# Altium schematic sheet WanderDrive_Gate_Driver_2.SchDoc (part 1 of 2)
size A3; SheetNumber: 2; SheetTotal: 4
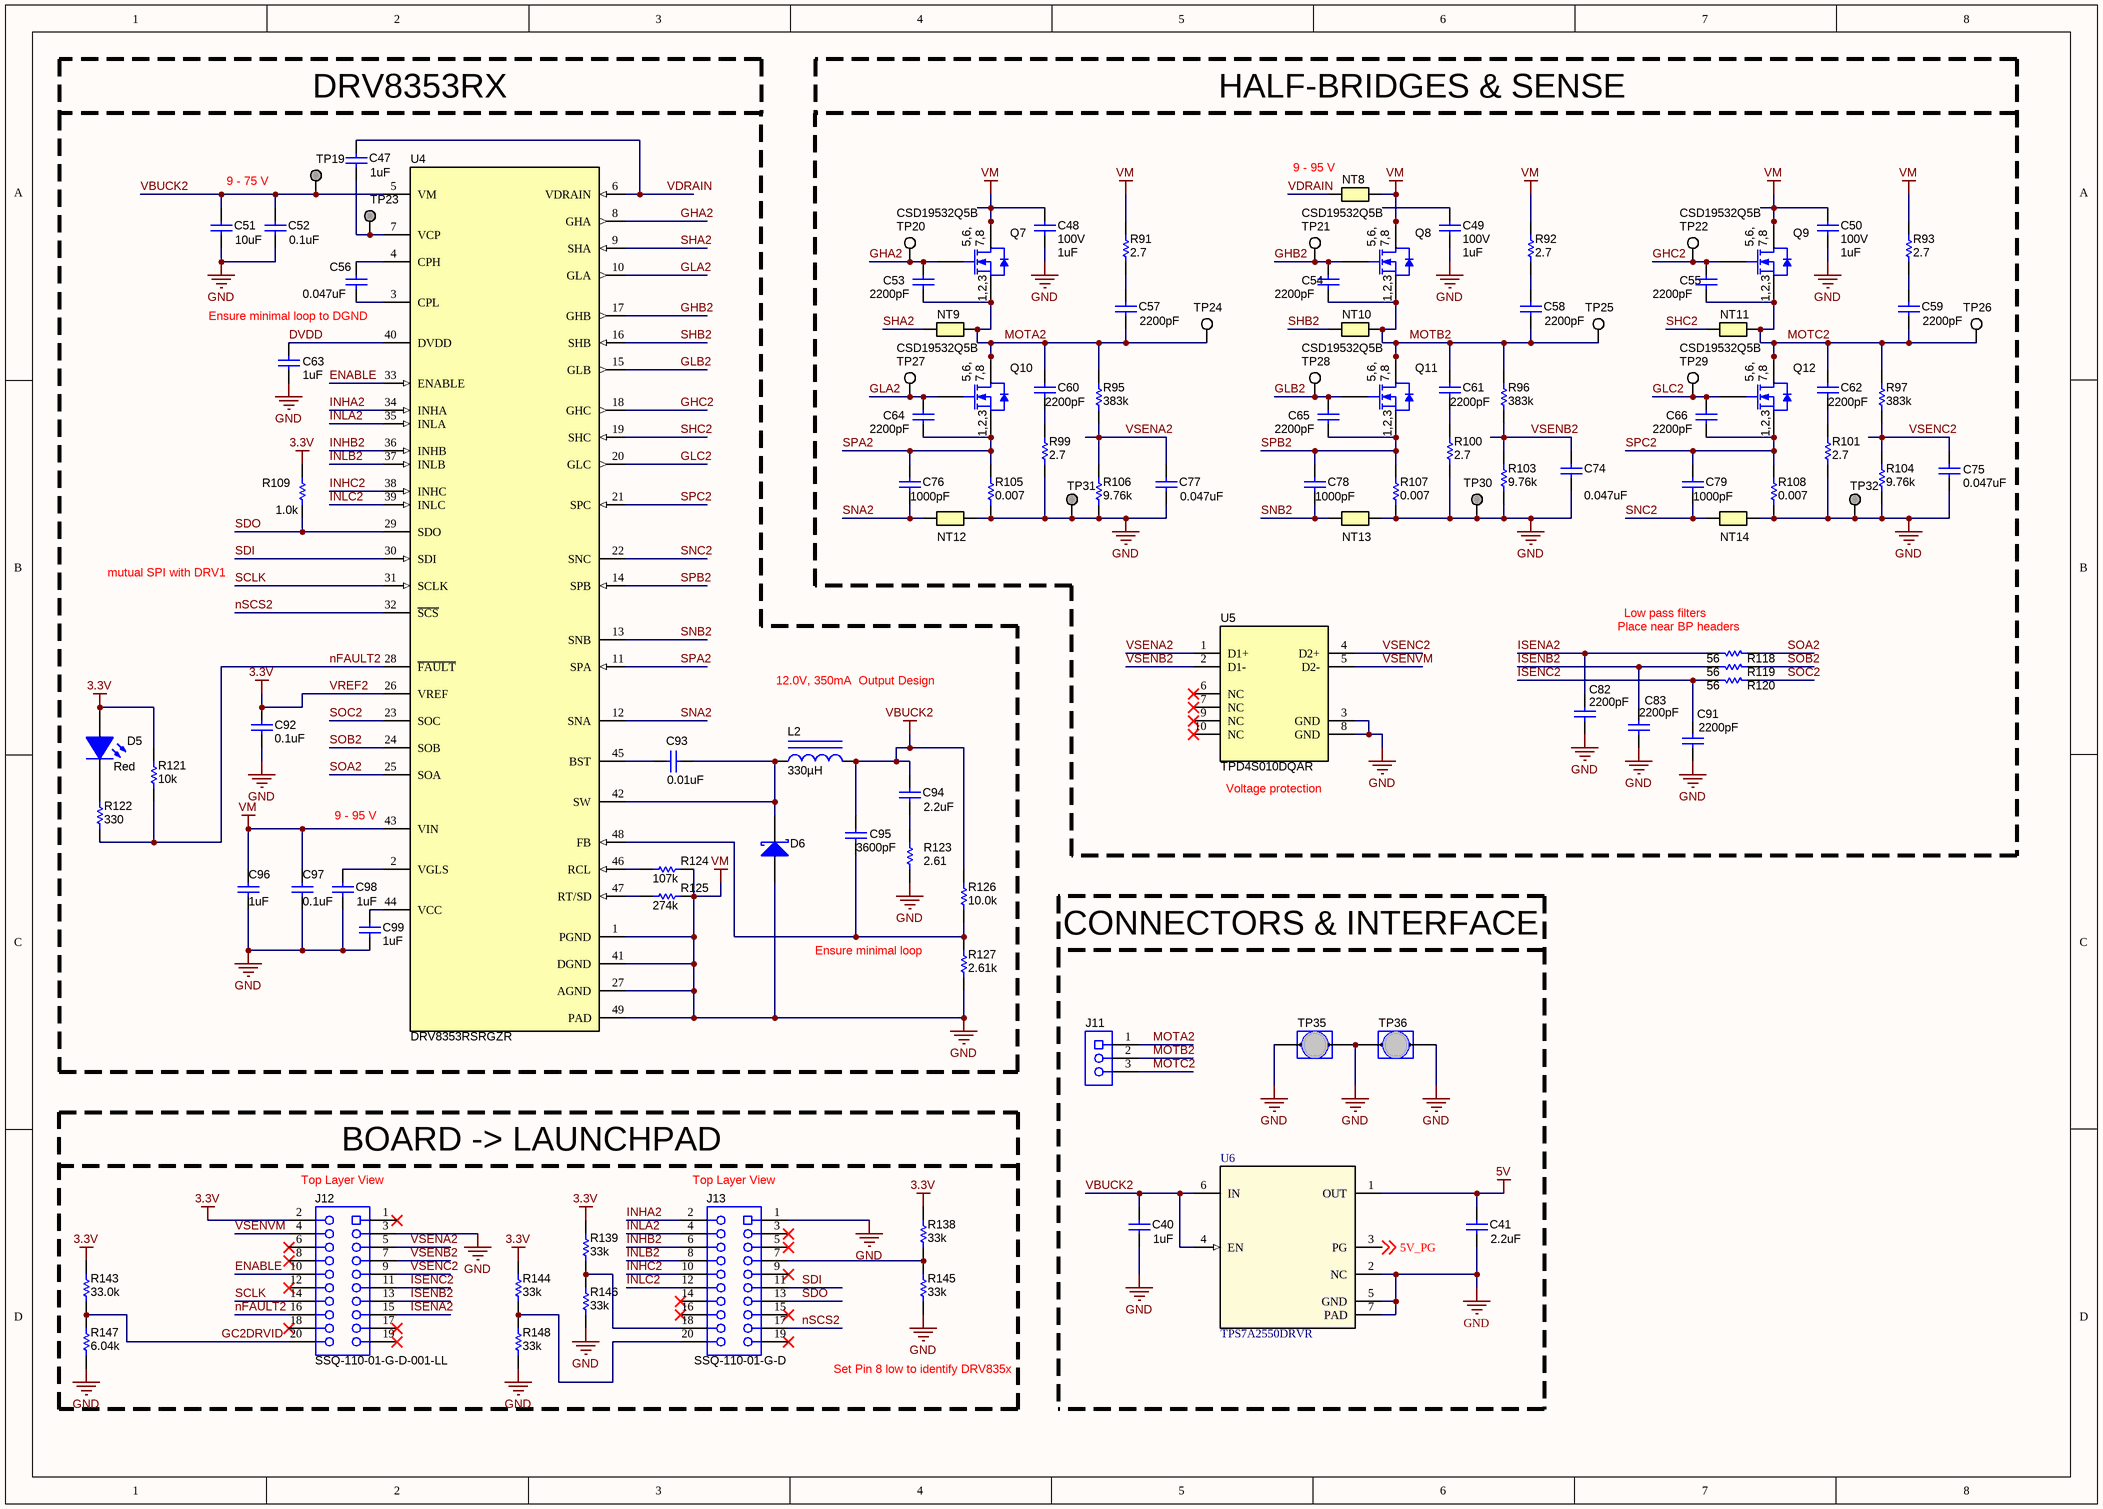
[diagram p0: WanderDrive_Gate_Driver_2.SchDoc]

## Parts
C40  ValueDisplayed: 1uF  [0805L]  (hidden comment: CL21B105KBFNNNE)
C41  ValueDisplayed: 2.2uF  [1210_270L]  (hidden comment: GRM32ER71K475KE14L)
C47  ValueDisplayed: 1uF  [1206_180M]  (hidden comment: CL31B105KCHNNNE)
C48  VDC_V: 100V  ValueDisplayed: 1uF  [1206_180M]  (hidden comment: CL31B105KCHNNNE)
C49  VDC_V: 100V  ValueDisplayed: 1uF  [1206_180M]  (hidden comment: CL31B105KCHNNNE)
C50  VDC_V: 100V  ValueDisplayed: 1uF  [1206_180M]  (hidden comment: CL31B105KCHNNNE)
C51  ValueDisplayed: 10uF  [2220_280M]  (hidden comment: CGA9N3X7S2A106K230KE)
C52  ValueDisplayed: 0.1uF  [0805_HV]  (hidden comment: C2012X7R2A104K125AA)
C53  ValueDisplayed: 2200pF  [0603_HV]  (hidden comment: 06031C222KAT2A)
C54  ValueDisplayed: 2200pF  [0603_HV]  (hidden comment: 06031C222KAT2A)
C55  ValueDisplayed: 2200pF  [0603_HV]  (hidden comment: 06031C222KAT2A)
C56  ValueDisplayed: 0.047uF  [0805_HV]  (hidden comment: C2012X7R2A473K125AA)
C57  ValueDisplayed: 2200pF  [0603_HV]  (hidden comment: GRM188R72A222KA01D)
C58  ValueDisplayed: 2200pF  [0603_HV]  (hidden comment: GRM188R72A222KA01D)
C59  ValueDisplayed: 2200pF  [0603_HV]  (hidden comment: GRM188R72A222KA01D)
C60  ValueDisplayed: 2200pF  [0603_HV]  (hidden comment: GRM188R72A222KA01D)
C61  ValueDisplayed: 2200pF  [0603_HV]  (hidden comment: GRM188R72A222KA01D)
C62  ValueDisplayed: 2200pF  [0603_HV]  (hidden comment: GRM188R72A222KA01D)
C63  ValueDisplayed: 1uF  [0603L]  (hidden comment: EMK107B7105KA-T)
C64  ValueDisplayed: 2200pF  [0603_HV]  (hidden comment: 06031C222KAT2A)
C65  ValueDisplayed: 2200pF  [0603_HV]  (hidden comment: 06031C222KAT2A)
C66  ValueDisplayed: 2200pF  [0603_HV]  (hidden comment: 06031C222KAT2A)
C74  ValueDisplayed: 0.047uF  [0603L]  (hidden comment: 06033C473JAT2A)
C75  ValueDisplayed: 0.047uF  [0603L]  (hidden comment: 06033C473JAT2A)
C76  ValueDisplayed: 1000pF  [0603L]  (hidden comment: 885012206034)
C77  ValueDisplayed: 0.047uF  [0603L]  (hidden comment: 06033C473JAT2A)
C78  ValueDisplayed: 1000pF  [0603L]  (hidden comment: 885012206034)
C79  ValueDisplayed: 1000pF  [0603L]  (hidden comment: 885012206034)
C82  ValueDisplayed: 2200pF  [0603L]  (hidden comment: GRM188R71C222KA01D)
C83  ValueDisplayed: 2200pF  [0603L]  (hidden comment: GRM188R71C222KA01D)
C91  ValueDisplayed: 2200pF  [0603L]  (hidden comment: GRM188R71C222KA01D)
C92  ValueDisplayed: 0.1uF  [0603L]  (hidden comment: C0603C104J4RACTU)
C93  ValueDisplayed: 0.01uF  [0603L]  (hidden comment: C0603C103K4RACTU)
C94  ValueDisplayed: 2.2uF  [0805L]  (hidden comment: C2012X7R1V225K085AC)
C95  ValueDisplayed: 3600pF  [0603L]  (hidden comment: GRM1885C1H362JA01D)
C96  ValueDisplayed: 1uF  [1206_180M]  (hidden comment: CL31B105KCHNNNE)
C97  ValueDisplayed: 0.1uF  [0805_HV]  (hidden comment: C2012X7R2A104K125AA)
C98  ValueDisplayed: 1uF  [0603L]  (hidden comment: C1608X7R1C105K080AC)
C99  ValueDisplayed: 1uF  [0603L]  (hidden comment: C1608X7R1C105K080AC)
D5  value Red  [LED_LTST-C170_Red]  (hidden comment: LTST-C170KRKT)
D6  DFLS1200-7  [PowerDI123]  (value not drawn)
J11  1904150  [Phoenix_1904150]  (value not drawn)
J12  SSQ-110-01-G-D-001-LL  [Samtec_SSQ-110-01-x-D-001-LL]
J13  SSQ-110-01-G-D  [Samtec_SSQ-110-01-x-D]
L2  ValueDisplayed: 330µH  [WE-LQS_8040]  (hidden comment: 74404084331)
NT8  Net-Tie  [Net-Tie_50milWide_30milLong]  (value not drawn)  (net tie, no BOM)
NT9  Net-Tie  [Net-Tie_10mil]  (value not drawn)  (net tie, no BOM)
NT10  Net-Tie  [Net-Tie_10mil]  (value not drawn)  (net tie, no BOM)
NT11  Net-Tie  [Net-Tie_10mil]  (value not drawn)  (net tie, no BOM)
NT12  Net-Tie  [Net-Tie_10mil]  (value not drawn)  (net tie, no BOM)
NT13  Net-Tie  [Net-Tie_10mil]  (value not drawn)  (net tie, no BOM)
NT14  Net-Tie  [Net-Tie_10mil]  (value not drawn)  (net tie, no BOM)
Q7  CSD19532Q5B  [DNK0008A]
Q8  CSD19532Q5B  [DNK0008A]
Q9  CSD19532Q5B  [DNK0008A]
Q10  CSD19532Q5B  [DNK0008A]
Q11  CSD19532Q5B  [DNK0008A]
Q12  CSD19532Q5B  [DNK0008A]
R91  ValueDisplayed: 2.7  [0805_HV]  (hidden comment: CRCW08052R70JNEA)
R92  ValueDisplayed: 2.7  [0805_HV]  (hidden comment: CRCW08052R70JNEA)
R93  ValueDisplayed: 2.7  [0805_HV]  (hidden comment: CRCW08052R70JNEA)
R95  ValueDisplayed: 383k  [0603_HV]  (hidden comment: CRCW0603383KFKEA)
R96  ValueDisplayed: 383k  [0603_HV]  (hidden comment: CRCW0603383KFKEA)
R97  ValueDisplayed: 383k  [0603_HV]  (hidden comment: CRCW0603383KFKEA)
R99  ValueDisplayed: 2.7  [0805_HV]  (hidden comment: CRCW08052R70JNEA)
R100  ValueDisplayed: 2.7  [0805_HV]  (hidden comment: CRCW08052R70JNEA)
R101  ValueDisplayed: 2.7  [0805_HV]  (hidden comment: CRCW08052R70JNEA)
R103  ValueDisplayed: 9.76k  [0603L]  (hidden comment: RC0603FR-079K76L)
R104  ValueDisplayed: 9.76k  [0603L]  (hidden comment: RC0603FR-079K76L)
R105  ValueDisplayed: 0.007  [CRE2512-R5_R9]  (hidden comment: CRE2512-FZ-R007E-3)
R106  ValueDisplayed: 9.76k  [0603L]  (hidden comment: RC0603FR-079K76L)
R107  ValueDisplayed: 0.007  [CRE2512-R5_R9]  (hidden comment: CRE2512-FZ-R007E-3)
R108  ValueDisplayed: 0.007  [CRE2512-R5_R9]  (hidden comment: CRE2512-FZ-R007E-3)
R109  ValueDisplayed: 1.0k  [0603L]  (hidden comment: RCA06031K00JNEA)
R118  value 56  [0603L]  (hidden comment: CRCW060356R0JNEA)
R119  value 56  [0603L]  (hidden comment: CRCW060356R0JNEA)
R120  value 56  [0603L]  (hidden comment: CRCW060356R0JNEA)
R121  ValueDisplayed: 10k  [0603L]  (hidden comment: RC0603JR-0710KL)
R122  ValueDisplayed: 330  [0603L]  (hidden comment: CRCW0603330RJNEA)
R123  ValueDisplayed: 2.61  [0603L]  (hidden comment: CRCW06032R61FKEA)
R124  ValueDisplayed: 107k  [0603L]  (hidden comment: RC0603FR-07107KL)
R125  ValueDisplayed: 274k  [0603_HV]  (hidden comment: RC0603FR-07274KL)
R126  ValueDisplayed: 10.0k  [0603L]  (hidden comment: RG1608P-103-B-T5)
R127  ValueDisplayed: 2.61k  [0603L]  (hidden comment: RG1608P-2611-B-T5)
R138  ValueDisplayed: 33k  [0603L]  (hidden comment: Resistor)
R139  ValueDisplayed: 33k  [0603L]  (hidden comment: Resistor)
R143  ValueDisplayed: 33.0k  [0603L]  (hidden comment: MCT06030C3302FP500)
R144  ValueDisplayed: 33k  [0603L]  (hidden comment: Resistor)
R145  ValueDisplayed: 33k  [0603L]  (hidden comment: Resistor)
R146  ValueDisplayed: 33k  [0603L]  (hidden comment: Resistor)
R147  ValueDisplayed: 6.04k  [0603L]  (hidden comment: RG1608P-6041-B-T5)
R148  ValueDisplayed: 33k  [0603L]  (hidden comment: Resistor)
TP19  TP_SM_1MM  [TP_SM_1MM]  (value not drawn)  (no BOM)
TP20  5002  [Keystone5002]  (value not drawn)
TP21  5002  [Keystone5002]  (value not drawn)
TP22  5002  [Keystone5002]  (value not drawn)
TP23  TP_SM_1MM  [TP_SM_1MM]  (value not drawn)  (no BOM)
TP24  5002  [Keystone5002]  (value not drawn)
TP25  5002  [Keystone5002]  (value not drawn)
TP26  5002  [Keystone5002]  (value not drawn)
TP27  5002  [Keystone5002]  (value not drawn)
TP28  5002  [Keystone5002]  (value not drawn)
TP29  5002  [Keystone5002]  (value not drawn)
TP30  TP_SM_1MM  [TP_SM_1MM]  (value not drawn)  (no BOM)
TP31  TP_SM_1MM  [TP_SM_1MM]  (value not drawn)  (no BOM)
TP32  TP_SM_1MM  [TP_SM_1MM]  (value not drawn)  (no BOM)
TP35  D3082-05  [Harwin_D3082-05]  (value not drawn)
TP36  D3082-05  [Harwin_D3082-05]  (value not drawn)
U4  DRV8353RSRGZR  [RGZ0048L]
U5  TPD4S010DQAR  [DQA0010A]
U6  TPS7A2550DRVR  [DRV0006A]

## Blocks framed on the sheet
BOARD -> LAUNCHPAD: J12 J13 R138 R139 R143-R148

## Nets
5V: C41.1 U6.1(OUT)
GND: C40.2 C41.2 C48.1 C48.2 C49.2 C50.1 C50.2 C51.2 C52.2 C63.2 C74.2 C75.2 C77.2 C82.2 C83.2 C91.2 C92.2 C96.1 C96.2 C97.1 C97.2 C98.2 C99.1 D6.2(A) J12.3 J13.1 NT8.2 NT12.2 NT13.2 NT14.2 Q7.5(D) Q7.6(D) Q7.7(D) Q7.8(D) Q7.9(D) Q8.5(D) Q8.6(D) Q8.7(D) Q8.8(D) Q8.9(D) Q9.5(D) Q9.6(D) Q9.7(D) Q9.8(D) Q9.9(D) R91.2 R92.2 R93.2 R99.1 R100.1 R101.1 R103.1 R104.1 R105.1 R106.1 R107.1 R108.1 R123.1 R124.2 R125.2 R127.1 R145.1 R146.1 R147.1 R148.1 TP30.1 TP31.1 TP32.1 TP35.1 TP35.2 TP36.1 TP36.2 U4.1(PGND) U4.27(AGND) U4.41(DGND) U4.43(VIN) U4.49(PAD) U5.3(GND) U5.8(GND) U6.2(NC) U6.5(GND) U6.7(PAD)  [also labelled VM]
VBUCK2: C40.1 C51.1 C52.1 C94.1 C95.1 L2.2 R126.2 TP19.1 U4.5(VM) U6.4(EN) U6.6(IN)
VREF2: C92.1 D5.1(A) J12.2 R109.2 R121.2 R138.2 R139.2 R143.2 R144.2 U4.26(VREF)  [also labelled 3.3V]
5V_PG: U6.3(PG) ; off-sheet 5V_PG
DVDD: C63.1 U4.40(DVDD)
ENABLE: J12.10 U4.33(ENABLE)
GC2DRVID: J12.20 R143.1 R147.2
GHA2: C53.1 Q7.4(G) TP20.1 U4.8(GHA)
GHB2: C54.1 Q8.4(G) TP21.1 U4.17(GHB)
GHC2: C55.1 Q9.4(G) TP22.1 U4.18(GHC)
GLA2: C64.1 Q10.4(G) TP27.1 U4.10(GLA)
GLB2: C65.1 Q11.4(G) TP28.1 U4.15(GLB)
GLC2: C66.1 Q12.4(G) TP29.1 U4.20(GLC)
INHA2: J13.2 U4.34(INHA)
INHB2: J13.6 U4.36(INHB)
INHC2: J13.10 U4.38(INHC)
INLA2: J13.4 U4.35(INLA)
INLB2: J13.8 U4.37(INLB)
INLC2: J13.12 U4.39(INLC)
ISENA2: C82.1 J12.15 R118.2
ISENB2: C83.1 J12.13 R119.2
ISENC2: C91.1 J12.11 R120.2
MOTA2: C53.2 C57.2 C60.1 J11.1 NT9.2 Q7.1(S) Q7.2(S) Q7.3(S) Q10.5(D) Q10.6(D) Q10.7(D) Q10.8(D) Q10.9(D) R95.2 TP24.1
MOTB2: C54.2 C58.2 C61.1 J11.2 NT10.2 Q8.1(S) Q8.2(S) Q8.3(S) Q11.5(D) Q11.6(D) Q11.7(D) Q11.8(D) Q11.9(D) R96.2 TP25.1
MOTC2: C55.2 C59.2 C62.1 J11.3 NT11.2 Q9.1(S) Q9.2(S) Q9.3(S) Q12.5(D) Q12.6(D) Q12.7(D) Q12.8(D) Q12.9(D) R97.2 TP26.1
nFAULT2: J12.16 R121.1 R122.1 U4.28(~{FAULT})
nSCS2: J13.17 U4.32(~{SCS})
SCLK: J12.14 U4.31(SCLK)
SDI: J13.11 U4.30(SDI)
SDO: J13.13 R109.1 U4.29(SDO)
SHA2: NT9.1 U4.9(SHA)
SHB2: NT10.1 U4.16(SHB)
SHC2: NT11.1 U4.19(SHC)
SNA2: C76.2 NT12.1 U4.12(SNA)
SNB2: C78.2 NT13.1 U4.13(SNB)
SNC2: C79.2 NT14.1 U4.22(SNC)
SOA2: R118.1 U4.25(SOA)
SOB2: R119.1 U4.24(SOB)
SOC2: R120.1 U4.23(SOC)
SPA2: C64.2 C76.1 Q10.1(S) Q10.2(S) Q10.3(S) R105.2 U4.11(SPA)
SPB2: C65.2 C78.1 Q11.1(S) Q11.2(S) Q11.3(S) R107.2 U4.14(SPB)
SPC2: C66.2 C79.1 Q12.1(S) Q12.2(S) Q12.3(S) R108.2 U4.21(SPC)
VDRAIN: C47.1 NT8.1 U4.6(VDRAIN)
VSENA2: C77.1 J12.5 R95.1 R106.2 U5.1(D1+)
VSENB2: C74.1 J12.7 R96.1 R103.2 U5.2(D1-)
VSENC2: C75.1 J12.9 R97.1 R104.2 U5.4(D2+)
VSENVM: J12.4 U5.5(D2-)
NetC47_2: C47.2 TP23.1 U4.7(VCP)
NetC56_1: C56.1 U4.4(CPH)
NetC56_2: C56.2 U4.3(CPL)
NetC57_1: C57.1 R91.1
NetC58_1: C58.1 R92.1
NetC59_1: C59.1 R93.1
NetC60_2: C60.2 R99.2
NetC61_2: C61.2 R100.2
NetC62_2: C62.2 R101.2
NetC93_1: C93.1 D6.1(K) L2.1 U4.42(SW)
NetC93_2: C93.2 U4.45(BST)
NetC94_2: C94.2 R123.2
NetC95_2: C95.2 R126.1 R127.2 U4.48(FB)
NetC98_1: C98.1 U4.2(VGLS)
NetC99_2: C99.2 U4.44(VCC)
NetD5_2: D5.2(K) R122.2
NetJ13_7: J13.7 R138.1 R145.2
NetJ13_18: J13.18 R139.1 R146.2
NetJ13_20: J13.20 R144.1 R148.2
NetR124_1: R124.1 U4.46(RCL)
NetR125_1: R125.1 U4.47(RT/SD)

Not connected (* = marked no-connect by the designer): C49 1; J12 1* 6* 8* 12* 17* 18* 19*; J13 3* 5* 9* 14* 15* 16* 19*; U5 6(NC)* 7(NC)* 9(NC)* 10(NC)*

## Notes on the sheet
- (near C47) DRV8353RX
- HALF-BRIDGES & SENSE
- 9 - 75 V
- (near NT8) 9 - 95 V
- Ensure minimal loop to DGND
- mutual SPI with DRV1
- Low pass filters
- Place near BP headers
- 12.0V, 350mA  Output Design
- (near U5) Voltage protection
- (near U4) 9 - 95 V
- CONNECTORS & INTERFACE
- Ensure minimal loop
- (near J12) Top Layer View
- (near J13) Top Layer View
- Set Pin 8 low to identify DRV835x
- Title
- Size:
- Date:
- A3
- Number:
- Time:
- Revision:
- Sheet
- of
- File:
- (in symbol CMP-0000958-3) 5,6,; 7,8; 1,2,3